# Altium schematic sheet motorEncoder.SchDoc
size A
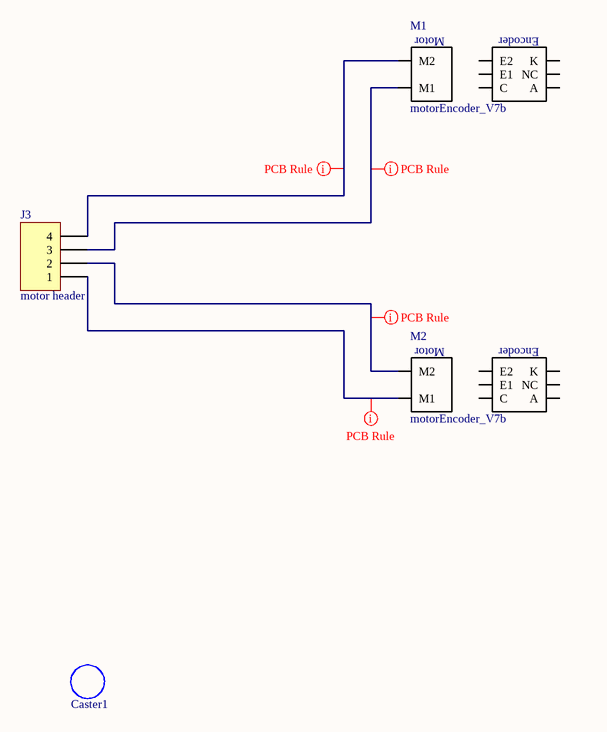
[diagram p0: motorEncoder.SchDoc]

## Parts
Caster1  non connect  [3/4"CASTER2]  (value not drawn)
J3  motor header  [HDR1X4]
M1  motorEncoder_V7b  [motorEncoder_V7b]
M2  motorEncoder_V7b  [motorEncoder_V7b]

## Nets
NetJ3_1: J3.1 M2.M1
NetJ3_2: J3.2 M2.M2
NetJ3_3: J3.3 M1.M1
NetJ3_4: J3.4 M1.M2

Not connected (* = marked no-connect by the designer): M1 A C E1 E2 K NC; M2 A C E1 E2 K NC

## Layout directives
rule Width Constraint [Pref Width = 20mil    Min Width = 10mil    Max Width = 25mil]: NetJ3_1, NetJ3_2, NetJ3_3, NetJ3_4

## Notes on the sheet
- (in symbol motorEncoder_V7b) Motor; Encoder

## Library data of the parts
Caster1 = Caster 3/4in: This is just a space saver to get the caster onto the pcb
J3 = Header 4: Header, 4-Pin; LatestRevisionDate: 17-Jul-2002; LatestRevisionNote: Re-released for DXP Platform.; Publisher: Altium Limited